# EAGLE schematic attiny84 (EAGLE 9.5.2)
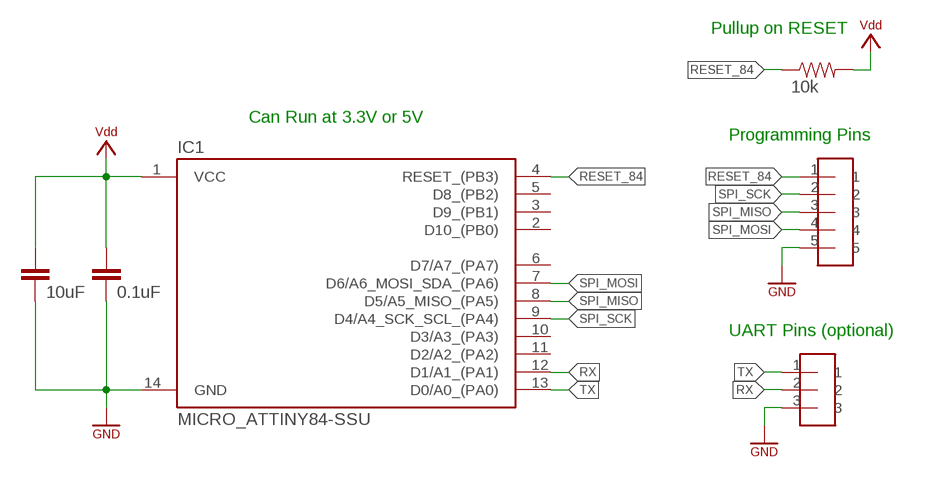
[diagram p0: schematic, sheet 1]

## Parts
C1  0.1uF  COMPONENT_CAP-0805  [0805]
C2  10uF  COMPONENT_CAP-0805  [0805]
IC1  MICRO_ATTINY84-SSU  [SOIC14]
R1  10k  COMPONENT_RESISTOR-0805  [0805]
U$1  HEADER-3-TESTPOINT  [TESTPOINT-3]
U$2  HEADER-5-TESTPOINT  [TESTPOINT-5]

## Nets
GND: C1.2 C2.2 IC1.14(GND) U$1.3 U$2.5 ; supply symbol labelled SYMBOL_GND
RESET_84: IC1.4(RESET_(PB3)) R1.1 U$2.1
RX: IC1.12(D1/A1_(PA1)) U$1.2
SPI_MISO: IC1.8(D5/A5_MISO_(PA5)) U$2.3
SPI_MOSI: IC1.7(D6/A6_MOSI_SDA_(PA6)) U$2.4
SPI_SCK: IC1.9(D4/A4_SCK_SCL_(PA4)) U$2.2
TX: IC1.13(D0/A0_(PA0)) U$1.1
VDD: C1.1 C2.1 IC1.1(VCC) R1.2 ; supply symbol labelled SYMBOL_VDD
Unconnected: IC1.2(D10_(PB0)) IC1.3(D9_(PB1)) IC1.5(D8_(PB2)) IC1.6(D7/A7_(PA7)) IC1.10(D3/A3_(PA3)) IC1.11(D2/A2_(PA2))

## Notes on the sheet
- Pullup on RESET
- Can Run at 3.3V or 5V
- Programming Pins
- UART Pins (optional)

## Library data of the parts
C1 C2 = homemade-hardware:COMPONENT_CAP: Capacitor Standard 0603 ceramic capacitor, and 0.1" leaded capacitor.
IC1 = homemade-hardware:MICRO_ATTINY84
R1 = homemade-hardware:COMPONENT_RESISTOR
U$1 = homemade-hardware:HEADER-3: NPTC081KFXC-RC <https://www.digikey.com/product-detail/en/sullins-connector-solutions/NPTC081KFXC-RC/S5600-ND/776058>: Vertical Female SMD Headers TSM-110-01-T-SV <https://www.digikey.com/product-detail/en/samtec-inc/TSM-110-01-T-SV/SAM12267-ND/6691889>: Vertical Male SMD Headers M20-8890845 <https://www.digikey.com/products/en?keywords=952-3236-ND>: Horizontal Male SMD Headers M20-7910842R <https://www.digikey.com/product-detail/en/harwin-inc/M20-7910842R/952-3200-6-ND/6559341>: Horizontal Female SMD Headers
U$2 = homemade-hardware:HEADER-5: NPTC081KFXC-RC <https://www.digikey.com/product-detail/en/sullins-connector-solutions/NPTC081KFXC-RC/S5600-ND/776058>: Vertical Female SMD Headers TSM-110-01-T-SV <https://www.digikey.com/product-detail/en/samtec-inc/TSM-110-01-T-SV/SAM12267-ND/6691889>: Vertical Male SMD Headers M20-8890845 <https://www.digikey.com/products/en?keywords=952-3236-ND>: Horizontal Male SMD Headers M20-7910842R <https://www.digikey.com/product-detail/en/harwin-inc/M20-7910842R/952-3200-6-ND/6559341>: Horizontal Female SMD Headers